# EAGLE design RFID-reader-schmatic (EAGLE 8.4.1)
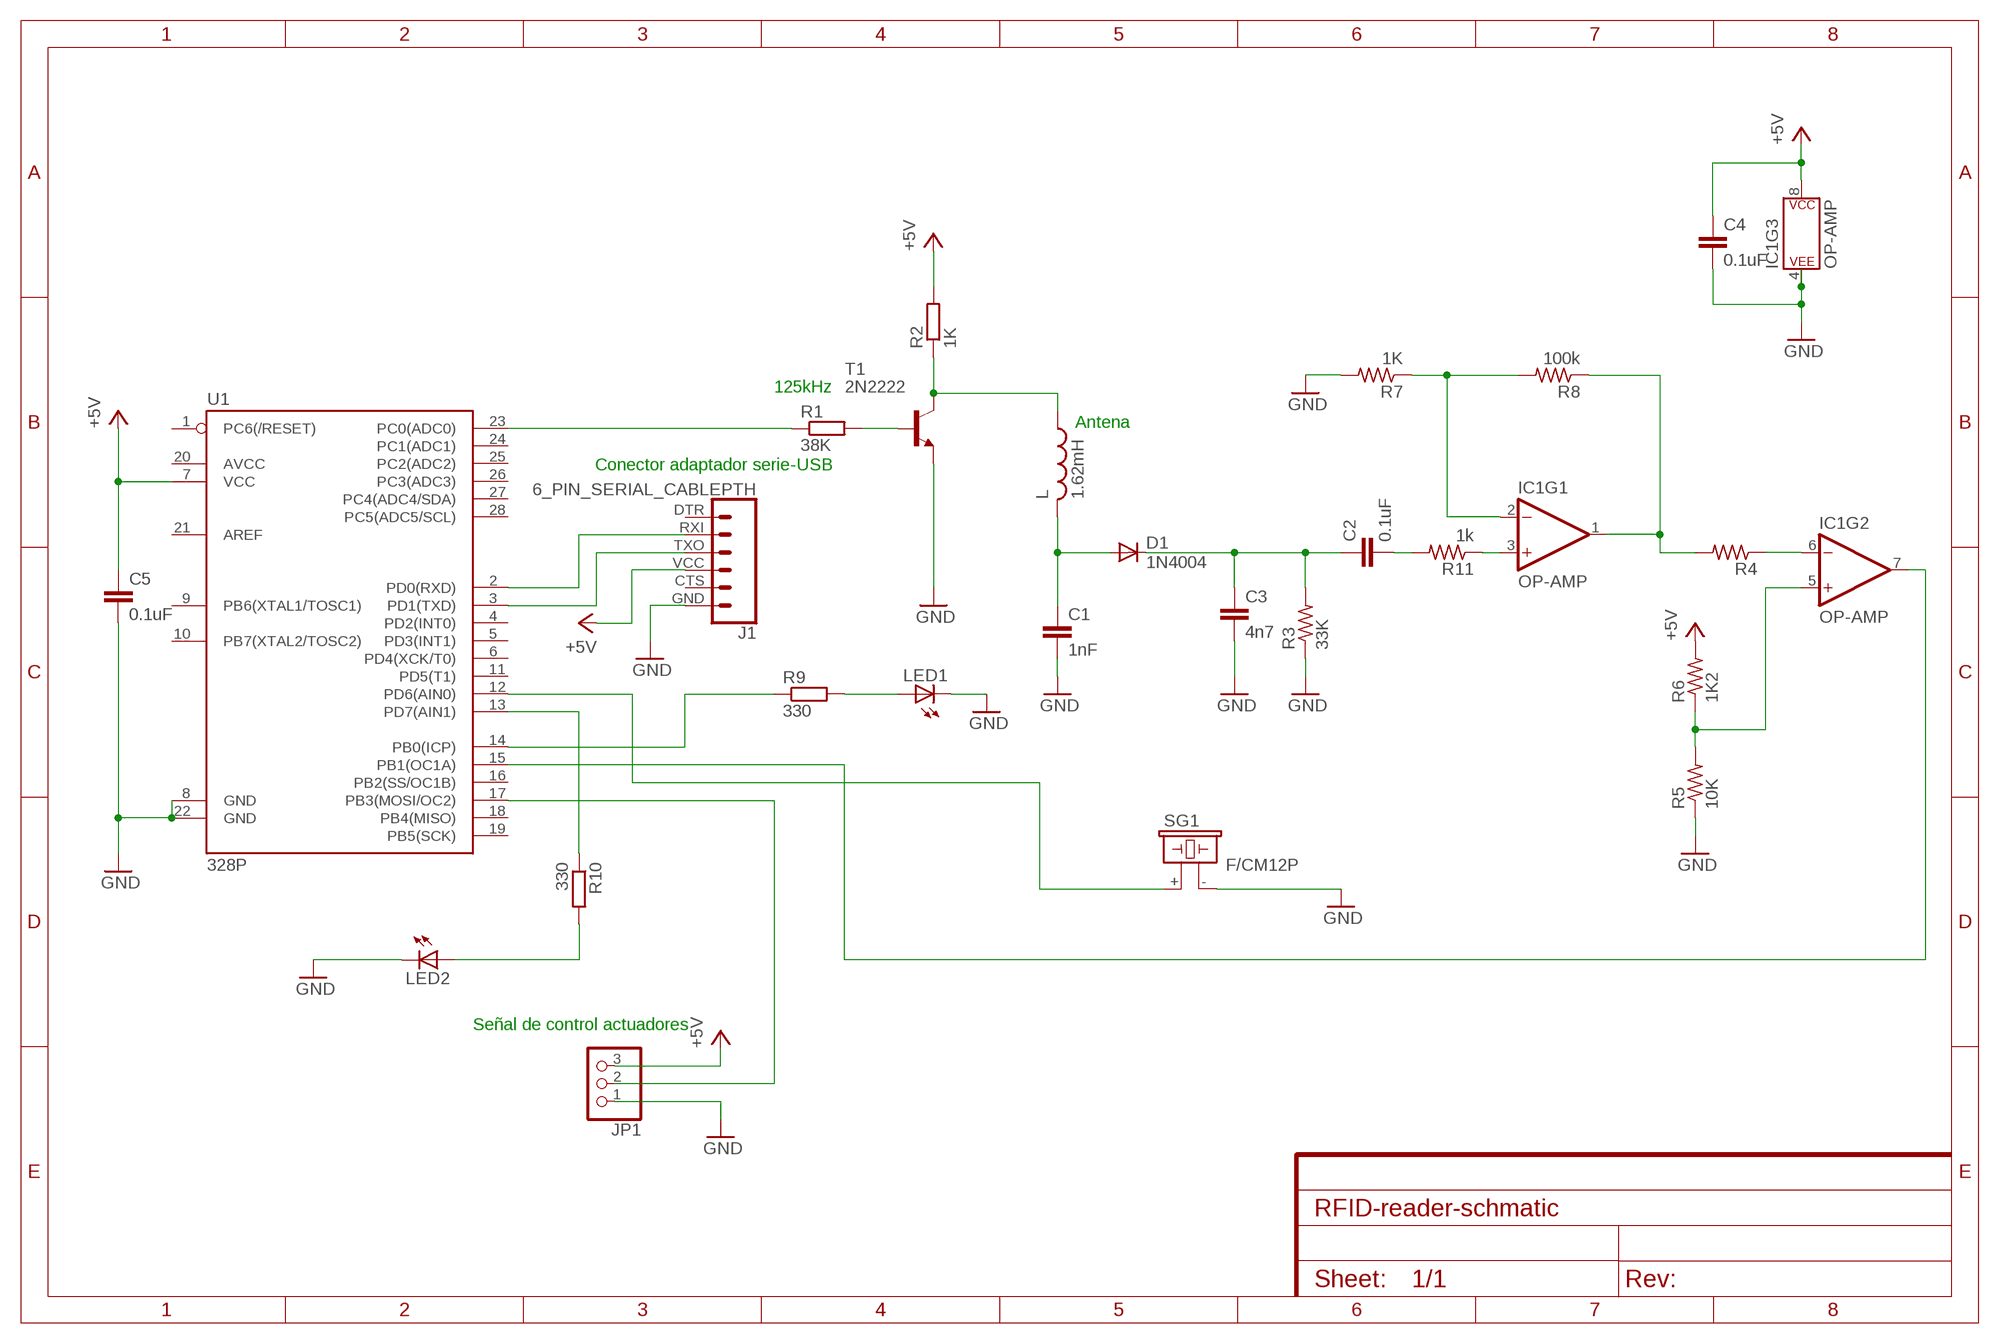
[diagram p0: schematic, sheet 1]
FRAME1 (FRAME-A4L): SPICEPREFIX: X

## Parts
C1  1nF  C2,5-3  [C2.5-3]
C2  0.1uF  C2,5-3  [C2.5-3]
C3  4n7  C2,5-3  [C2.5-3]
C4  0.1uF  C2,5-3  [C2.5-3]
C5  0.1uF  C2,5-3  [C2.5-3]
D1  1N4004  [DO41-10]
IC1  OP-AMP  OPAMP-DUALDIP  [DIP08]
J1  6_PIN_SERIAL_CABLEPTH  [FTDI_BASIC]
JP1  PINHD-1X3  [1X03]
L  1.62mH  L  [6000]
LED1  LED3MM  [LED3MM]
LED2  LED3MM  [LED3MM]
R1  38K  R-EU_0204/7  [0204/7]
R2  1K  R-EU_0204/7  [0204/7]
R3  33K  R-US_0204/7  [0204/7]
R4  R-US_0204/7  [0204/7]
R5  10K  R-US_0204/7  [0204/7]
R6  1K2  R-US_0204/7  [0204/7]
R7  1K  R-US_0204/7  [0204/7]
R8  100k  R-US_0204/7  [0204/7]
R9  330  R-EU_0204/7  [0204/7]
R10  330  R-EU_0204/7  [0204/7]
R11  1k  R-US_0204/7  [0204/7]
SG1  F/CM12P  [F/CM12P]
T1  2N2222  [TO92-EBC-OVAL]
U1  328P  ATMEGA328P_PDIP  [DIP28]

## Nets
GND: C1.2 C3.2 C4.2 C5.2 IC1.4(P$V-) J1.GND JP1.1 LED1.K(C) LED2.K(C) R3.1 R5.1 R7.2 SG1.- T1.E U1.8(GND) U1.22(GND)
N$1: R10.1 U1.13(PD7(AIN1))
N$2: L.1 R2.1 T1.C
N$3: R1.2 T1.B
N$4: R1.1 U1.23(PC0(ADC0))
N$5: C1.1 D1.A L.2
N$6: IC1.6(-IN) R4.1
N$7: R9.1 U1.14(PB0(ICP))
N$8: C2.1 C3.1 D1.C R3.2
N$11: IC1.7(OUT) U1.15(PB1(OC1A))
N$13: IC1.5(+IN) R5.2 R6.1
N$14: C4.1 IC1.8(P$V+) ; supply symbol labelled +5V
N$16: C2.2 R11.2
N$17: IC1.1(OUT) R4.2 R8.1
N$18: IC1.2(-IN) R7.1 R8.2
N$19: SG1.+ U1.12(PD6(AIN0))
N$20: LED1.A R9.2
N$21: JP1.2 U1.17(PB3(MOSI/OC2))
N$23: J1.RXI U1.2(PD0(RXD))
N$24: J1.TXO U1.3(PD1(TXD))
N$26: LED2.A R10.2
N$27: IC1.3(+IN) R11.1
VCC: C5.1 J1.VCC JP1.3 R2.2 R6.2 U1.7(VCC) ; supply symbol labelled +5V
Unconnected: J1.CTS J1.DTR U1.1(PC6(/RESET)) U1.4(PD2(INT0)) U1.5(PD3(INT1)) U1.6(PD4(XCK/T0)) U1.9(PB6(XTAL1/TOSC1)) U1.10(PB7(XTAL2/TOSC2)) U1.11(PD5(T1)) U1.16(PB2(SS/OC1B)) U1.18(PB4(MISO)) U1.19(PB5(SCK)) U1.20(AVCC) U1.21(AREF) U1.24(PC1(ADC1)) U1.25(PC2(ADC2)) U1.26(PC3(ADC3)) U1.27(PC4(ADC4/SDA)) U1.28(PC5(ADC5/SCL))

## Notes on the sheet
- 125kHz
- Antena
- Conector adaptador serie-USB
- Señal de control actuadores

## Library data of the parts
C1-C5 = capacitor-wima:C: CAPACITOR naming: grid - package width
D1 = adafruit:1N4004: DIODE General purpose 1N400x type rectifier (With bigger pads) http://www.ladyada.net/library/pcb/eaglelibrary.html
IC1 = SparkFun-IC-Amplifiers:OPAMP-DUAL: Generic op-amp footprint This component is for the standard 358 pinning of a dual op-amp From the LM358 datasheet: Pin 1: Output A Pin 2: Inverting Input A Pin 3: Non-Inverting Input A Pin 4: Gnd Pin 5: Non-Inverting Input B Pin 6: Inverting Input B Pin 7: Output B Pin 8: V+; PROD_ID: NA-XXXXX
J1 = SparkFun-Connectors:6_PIN_SERIAL_CABLE: 6-pin header connection for use with the "FTDI BASIC" pinout - CABLE SIDE. Also known as "Arduino Serial Program Header". This is used on a design to provide a 6-pin connection point for serial communication usually from a USB cable (D+/D-) to these headers (RX/TX). It also has the remaining pins necessary for programming in the Arduino evironment (DTR, GND, and sometimes VCC). Note, this device has "CABLE" in the name. It is intended to be used on a design that usually lives on the end of your USB cable and prvides the converter chip (FTDI232 or FTDI231x) to commnicate serial RX/TX. The "sister" device, named "TARGET" is inteneded to be used on a design that contains a target micro-controller that you wish to program. You can populate with some of these: Female Headers <https://www.sparkfun.com/products/115> (PRT-00115) For reference (or to suit your programming needs) check out these designs: SparkFun FTDI Basic Breakout - 5V <https://www.sparkfun.com/products/9716> (DEV-09716) SparkFun FTDI Basic Breakout - 3.3V <https://www.sparkfun.com/products/9873> (DEV-09873) SparkFun FTDI SmartBasic <https://www.sparkfun.com/products/12935> (DEV-12935) SparkFun Beefy 3 - FTDI Basic Breakout <https://www.sparkfun.com/products/13746> (DEV-13746)
JP1 = adafruit:PINHD-1X3: PIN HEADER
L = adafruit:L
LED1 LED2 = adafruit:LED: LED OSRAM: - CHIPLED LG R971, LG N971, LY N971, LG Q971, LY Q971, LO R971, LY R971 LH N974, LH R974 LS Q976, LO Q976, LY Q976 LO Q996 - Hyper CHIPLED LW Q18S LB Q993, LB Q99A, LB R99A - SideLED LS A670, LO A670, LY A670, LG A670, LP A670 LB A673, LV A673, LT A673, LW A673 LH A674 LY A675 LS A676, LA A676, LO A676, LY A676, LW A676 LS A679, LY A679, LG A679 - Hyper Micro SIDELED® LS Y876, LA Y876, LO Y876, LY Y876 LT Y87S - SmartLED LW L88C, LW L88S LB L89C, LB L89S, LG L890 LS L89K, LO L89K, LY L89K LS L896, LA L896, LO L896, LY L896 - TOPLED LS T670, LO T670, LY T670, LG T670, LP T670 LSG T670, LSP T670, LSY T670, LOP T670, LYG T670 LG T671, LOG T671, LSG T671 LB T673, LV T673, LT T673, LW T673 LH T674 LS T676, LA T676, LO T676, LY T676, LB T676, LH T676, LSB T676, LW T676 LB T67C, LV T67C, LT T67C, LS T67K, LO T67K, LY T67K, LW E67C LS E67B, LA E67B, LO E67B, LY E67B, LB E67C, LV E67C, LT E67C LW T67C LS T679, LY T679, LG T679 LS T770, LO T770, LY T770, LG T770, LP T770 LB T773, LV T773, LT T773, LW T773 LH T774 LS E675, LA E675, LY E675, LS T675 LS T776, LA T776, LO T776, LY T776, LB T776 LHGB T686 LT T68C, LB T68C - Hyper Mini TOPLED® LB M676 - Mini TOPLED Santana® LG M470 LS M47K, LO M47K, LY M47K Source: http://www.osram.convergy.de/
R1 R2 R9 R10 = resistor:R-EU_: RESISTOR, European symbol
R3-R8 R11 = adafruit:R-US_: RESISTOR, American symbol
SG1 = buzzer:F/CM12P: BUZZER Source: Buerklin; OC_FARNELL: unknown; OC_NEWARK: unknown
T1 = adafruit:2N2222: NPN TRANSISTOR Big oval pads
U1 = SparkFun-IC-Microcontroller:ATMEGA328P_PDIP: Atmel 328P Through hole ATMEGA328P uC used in the Arduino 32kb flash, 1k EEPROM, 2k SRAM Datasheet <http://www.sparkfun.com/datasheets/Components/SMD/ATMega328.pdf> SparkFun Products Storefront component: AVR 28 Pin 20MHz 32K 6A/D - ATMega328P <https://www.sparkfun.com/products/9061> (COM-09061) SparkFun Simon Says - Through-Hole Soldering Kit <https://www.sparkfun.com/products/10547> (KIT-10547) SparkFun Learn to Solder - Simon Says <https://www.sparkfun.com/products/13708> (KIT-13708) SparkFun BigTime Watch Kit <https://www.sparkfun.com/products/11734> (KIT-11734) SparkFun ClockIt <https://www.sparkfun.com/products/10930> (KIT-10930) SparkFun Serial Enabled LCD Kit <https://www.sparkfun.com/products/10097> (LCD-10097) SparkFun Simon Tilts - Through Hole Soldering Kit <https://www.sparkfun.com/products/12634> (KIT-12634) SparkFun Frequency Counter Kit <https://www.sparkfun.com/products/10140> (KIT-10140) FabFM Radio Kit <https://www.sparkfun.com/products/11043> (KIT-11043) SparkFun Binary Blaster Kit <https://www.sparkfun.com/products/12037> (KIT-12037) SparkFun Metro-Gnome <https://www.sparkfun.com/products/9236> (KIT-09236) ATmega328 with Arduino Optiboot (Uno) <https://www.sparkfun.com/products/10524> (DEV-10524); PROD_ID: IC-09136

## Board
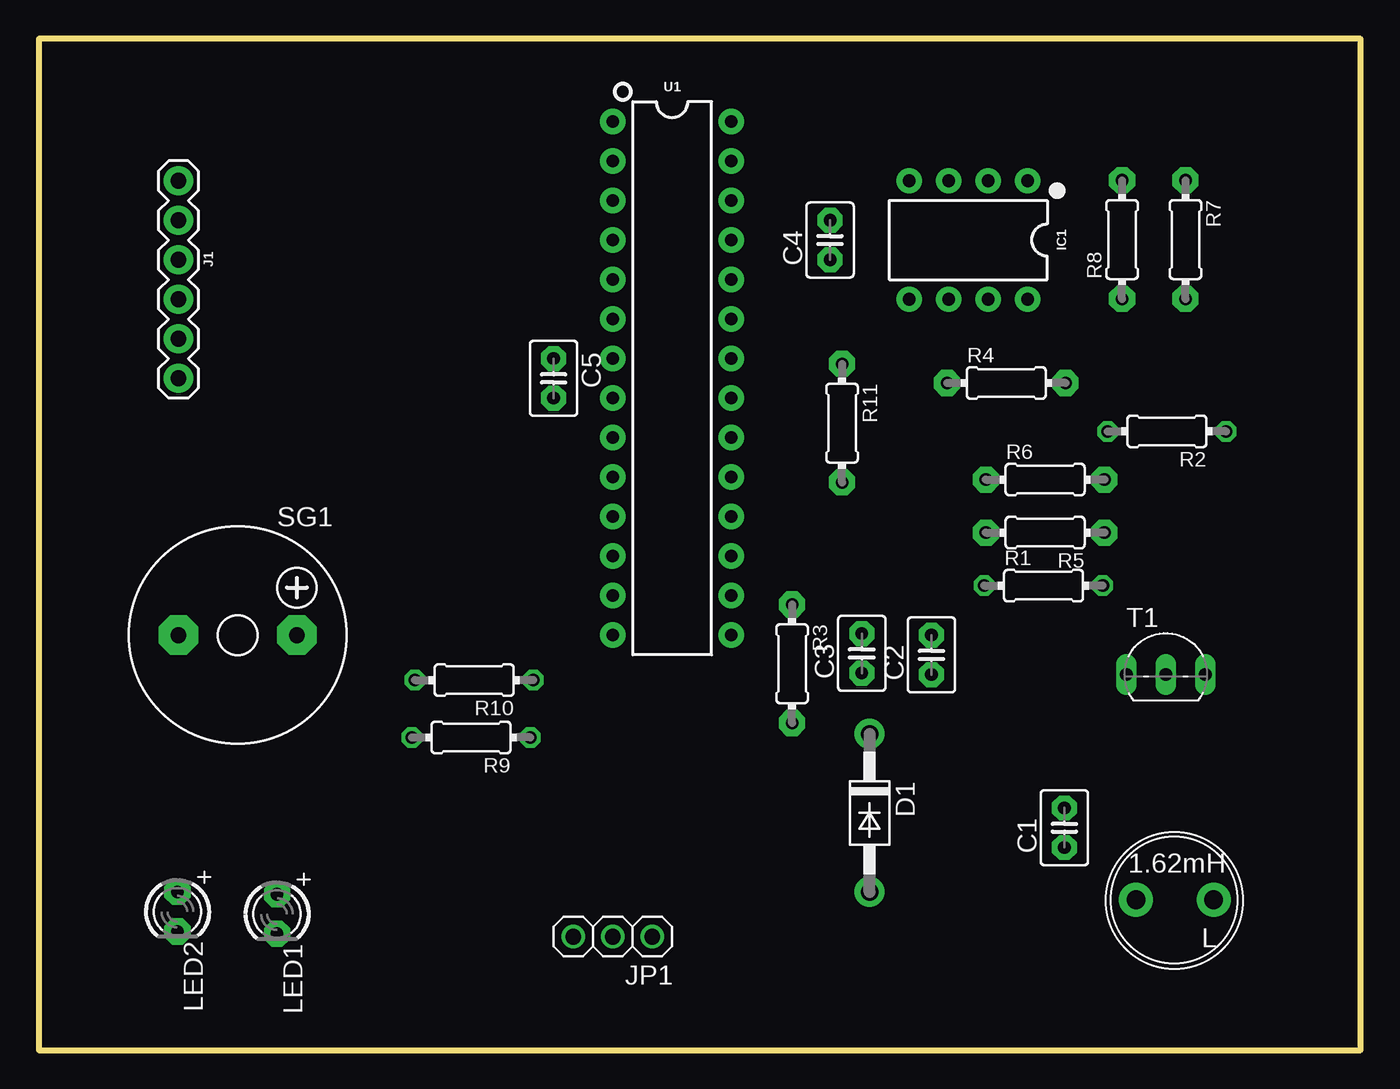
[diagram p1: board, top side]
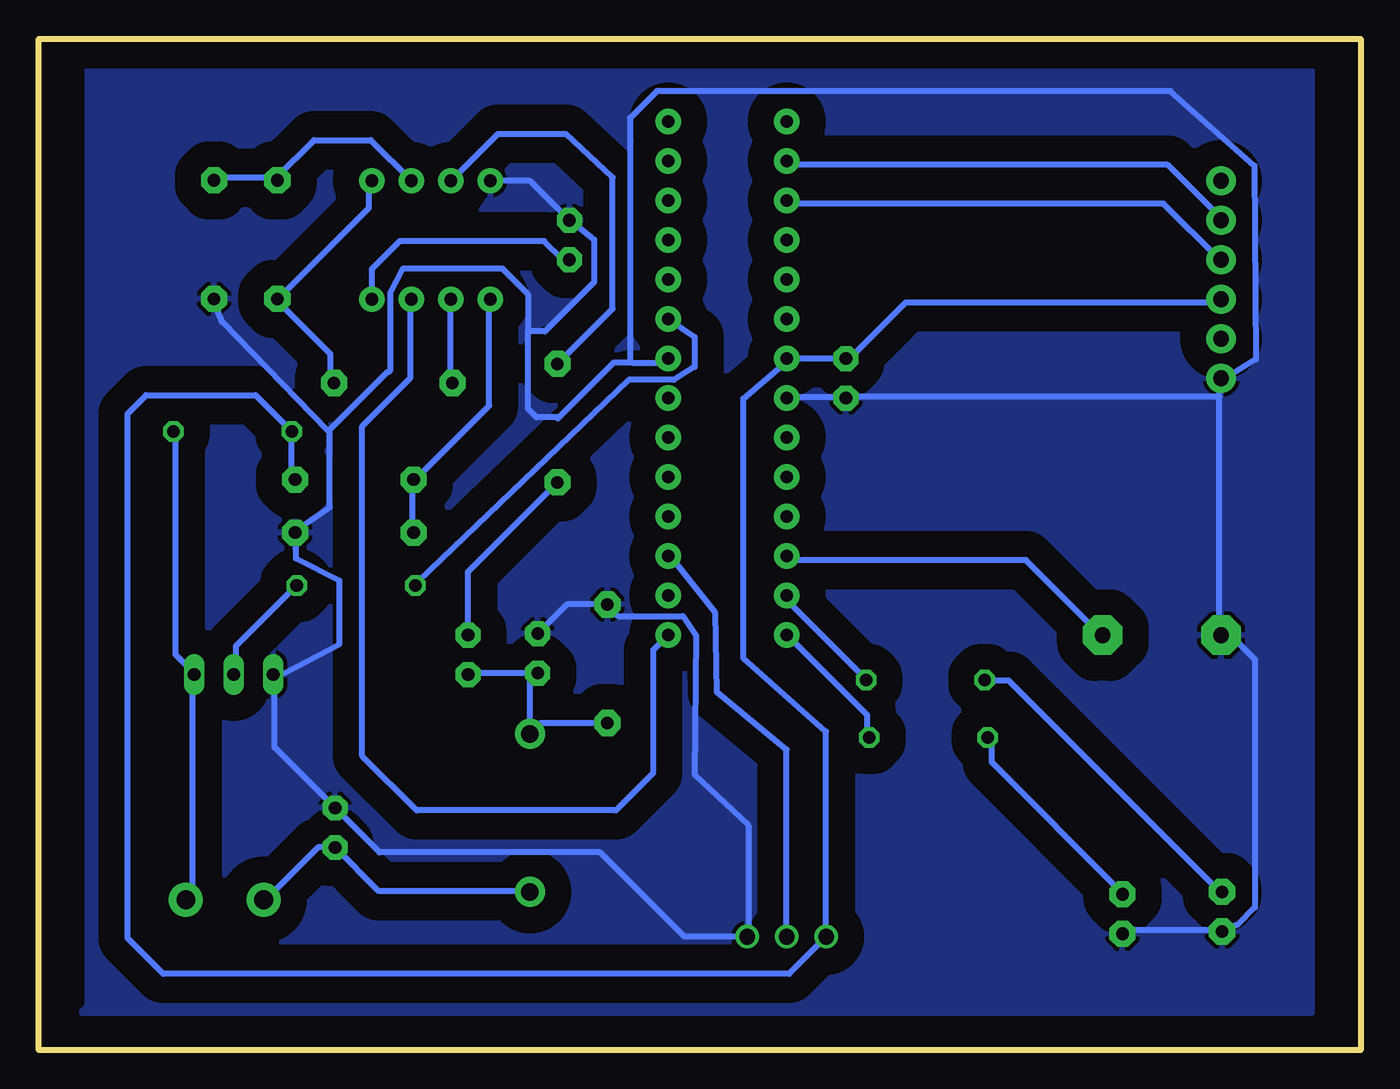
[diagram p2: board, bottom side, seen from below]

Size 85 x 65 mm. Coordinates in mm from the lower left corner, seen from the top.
Outline: 0,65 0,0 85,0 85,65 0,65
Copper layers (1*16): Top 0.035mm / dielectric 1.5mm / Bottom 0.035mm
Design rules "default *": minimum track width 0.4mm, minimum drill 0.4mm, track to track 6mil, track to pad 6mil, pad to pad 6mil, via to via 6mil, smd to smd 6mil, copper to edge 0.4mm, drill to drill 0.4mm, minimum pad ring 10mil, minimum via ring 8mil, stop-mask expansion 4mil, vias tented up to drill 0mil, thermal gap 10mil

### Footprints (pad centres in the part's own frame; a part is rotated, then mirrored left to right if it is on the bottom)
C2.5-3 = drill 0.813 pad 1.6 octagon: 1 -1.27,0; 2 1.27,0
DO41-10 = drill 1.118 pad 1.93: A 5.08,0; C -5.08,0
DIP08 = drill 0.813 pad 1.626: 1 -3.81,-3.81; 2 -1.27,-3.81; 3 1.27,-3.81; 4 3.81,-3.81; 5 3.81,3.81; 6 1.27,3.81; 7 -1.27,3.81; 8 -3.81,3.81
FTDI_BASIC = drill 1.016 pad 1.88: CTS 10.16,0; DTR 0,0; GND 12.7,0; RXI 2.54,0; TXO 5.08,0; VCC 7.62,0
1X03 = drill 1.016: 1 -2.54,0; 2 0,0; 3 2.54,0
6000 = drill 1.2 pad 2.184: 1 -2.5,0; 2 2.5,0
LED3MM = drill 0.813 pad 1.676 octagon: A -1.27,0; K 1.27,0
0204/7 = drill 0.813 octagon: 1 -3.81,0; 2 3.81,0
0204/7' = drill 0.813 pad 1.676 octagon: 1 -3.81,0; 2 3.81,0
F/CM12P = drill 1.016 pad 2.54 octagon: + 3.81,0; - -3.81,0
TO92-EBC-OVAL = drill 0.813 long: B 0,-1.27; C 2.54,-1.27; E -2.54,-1.27
DIP28 = drill 0.813 pad 1.626: 1 -16.51,-3.81; 2 -13.97,-3.81; 3 -11.43,-3.81; 4 -8.89,-3.81; 5 -6.35,-3.81; 6 -3.81,-3.81; 7 -1.27,-3.81; 8 1.27,-3.81; 9 3.81,-3.81; 10 6.35,-3.81; 11 8.89,-3.81; 12 11.43,-3.81; 13 13.97,-3.81; 14 16.51,-3.81; 15 16.51,3.81; 16 13.97,3.81; 17 11.43,3.81; 18 8.89,3.81; 19 6.35,3.81; 20 3.81,3.81; 21 1.27,3.81; 22 -1.27,3.81; 23 -3.81,3.81; 24 -6.35,3.81; 25 -8.89,3.81; 26 -11.43,3.81; 27 -13.97,3.81; 28 -16.51,3.81

### Placement (x,y rotation side)
C1  65.95,14.29 90 top
C2  57.4,25.4 90 top
C3  52.92,25.5 90 top
C4  50.88,52.07 90 top
C5  33.1,43.18 270 top
D1  53.42,15.24 270 top
IC1  59.77,52.07 180 top
J1  8.97,55.88 270 top
JP1  36.91,7.29 180 top
L  73.05,9.66 180 top
LED1  15.31,8.74 270 top
LED2  8.91,8.89 270 top
R1  64.61,29.85 0 top
R2  72.54,39.77 180 top
R3  33K  [0204/7']  48.44,24.83 270 top
R4  [0204/7']  62.21,42.88 0 top
R5  10K  [0204/7']  64.71,33.26 180 top
R6  1K2  [0204/7']  64.71,36.67 0 top
R7  1K  [0204/7']  73.74,52.1 270 top
R8  100k  [0204/7']  69.66,52.1 90 top
R9  27.79,20.09 180 top
R10  27.99,23.78 180 top
R11  1k  [0204/7']  51.65,40.3 270 top
SG1  12.78,26.67 0 top
T1  72.47,25.4 0 top
U1  40.72,43.18 270 top

### Tracks (layer width: path | path; a pad name or v marks a point on that pad's centre or on a via)
GND
  Bottom 0.4: LED1.K 15.16,7.73 9.09,7.73 LED2.K 8.81,7.73 7.91,8.06 6.8,9.17 6.8,25.11 7.91,26.21 SG1.- 9.09,26.79 9.09,41.98 | U1.8 36.71,41.98 33.12,41.98 C5.2 32.84,41.98 9.09,41.98 | 9.09,41.98 9.09,43.09 J1.GND 8.81,43.36 8.81,43.12 6.73,44.4 6.83,56.84 12.22,61.64 45.26,61.64 47,59.9 47,44.29 46.9,44.19 | 66.29,39.87 66.43,39.81 73.22,46.8 73.72,48.06 R7.2 | 66.29,39.87 66.29,34.9 68.47,33.42 R5.1 68.47,33.14 68.47,31.59 65.66,30.18 65.66,26.09 69.85,23.91 T1.E 69.85,24.03 69.85,19.46 C1.2 63.09,12.7 48.9,12.7 43.49,7.29 JP1.1 39.37,7.36 39.37,14.44 42.84,17.7 42.73,26.64 43.59,27.9 47.75,27.9 48.31,28.45 R3.1 51.05,28.64 C3.2 | 51.07,53.58 C4.2 | 55.76,55.79 IC1.4 53.42,55.88 C4.2 | 46.9,44.19 48.03,44.19 51.56,40.66 | 46.9,44.19 44.72,44.19 U1.22 | 51.62,40.6 51.56,40.66 | 53.55,46.2 53.55,41.23 52.99,40.66 51.56,40.66 | C4.2 50.79,53.31 49.29,52.1 49.29,49.37 52.45,46.2 53.55,46.2 | 53.55,46.2 53.55,48.58 55.21,50.24 61.56,50.24 62.39,48.71 62.39,43.71 62.5,43.6 62.56,43.6 66.29,39.87
  pour Bottom (isolate 1.676): 3.1,2.4 3.1,62.9 3.5,63.3 81.8,63.3 81.9,63.2 81.9,2.8 82.3,2.4 3.7,2.4
N$1
  Bottom 0.4: R10.1 32.01,24.03 36.98,29 U1.13
N$2
  Bottom 0.4: L.1 75.37,9.67 75.1,9.94 75.1,24.03 T1.C 75.1,24.31 76.2,25.41 76.2,39.5 R2.1
N$3
  Bottom 0.4: T1.B 72.34,24.31 72.34,25.96 68.47,29.83 R1.2
N$4
  Bottom 0.4: R1.1 60.84,29.81 60.65,30.11 47.07,43.09 44.16,43.09 42.84,43.92 42.84,45.85 44.44,46.95 U1.23
N$5
  Bottom 0.4: L.2 70.4,9.67 67.05,13.02 C1.1 63.15,10.22 53.55,10.22 D1.A
N$6
  Bottom 0.4: IC1.6 58.53,48.06 58.53,43.09 R4.1
N$7
  Bottom 0.4: R9.1 31.73,20.16 31.73,21.54 36.71,26.52 U1.14
N$8
  Bottom 0.4: R3.2 52.72,21.02 D1.C 53.42,23.73 C3.1 57.3,24.23 C2.1
N$11
  Bottom 0.4: U1.15 45.5,25.7 45.5,17.8 47.9,15.4 60.7,15.4 64.2,18.9 64.2,40.1 61.1,43.2 61.1,48.2 IC1.7
N$13
  Bottom 0.4: IC1.5 56.04,48.06 56.04,41.43 60.74,36.73 R6.1 61.01,36.46 61.01,33.42 R5.2
N$14
  Bottom 0.4: 63.6,48.34 IC1.8 63.6,48.28 63.6,50.2 61.8,52 52.5,52 51.3,50.8 C4.1
N$16
  Bottom 0.4: C2.2 57.4,30.74 R11.2
N$17
  Bottom 0.4: IC1.1 63.77,55.79 63.77,54.13 69.57,48.34 R8.1 69.57,48.06 66.26,44.74 66.26,43.09 R4.2
N$18
  Bottom 0.4: 69.77,56.07 R8.2 69.85,56.07 | 69.85,56.07 73.72,56.07 R7.1 | 69.85,56.07 69.73,56.07 67.3,58.5 63.66,58.5 IC1.2
N$19
  Bottom 0.4: U1.12 36.71,31.49 21.52,31.49 16.82,26.79 SG1.+
N$20
  Bottom 0.4: R9.2 23.73,19.89 23.73,18.5 15.44,10.22 LED1.A
N$21
  Bottom 0.4: 36.98,7.46 JP1.2 36.91,19.31 41.4,23 41.5,28.1 44.62,32.02 | 44.62,32.02 44.44,31.49 | 44.62,32.02 U1.17
N$23
  Bottom 0.4: U1.2 36.71,56.9 12.4,56.9 9.09,53.58 J1.RXI
N$24
  Bottom 0.4: U1.3 36.71,54.41 12.68,54.41 9.09,50.82 J1.TXO
N$26
  Bottom 0.4: R10.2 24,23.75 22.62,23.75 9.09,10.22 LED2.A
N$27
  Bottom 0.4: IC1.3 55.48,58.9 51.1,58.9 48.1,56.1 48.1,47.66 R11.1
VCC
  Bottom 0.4: R6.2 68.75,36.73 68.75,39.5 R2.2 71.06,42.1 78.1,42.1 79.3,40.9 79.3,7.2 77,4.9 36.76,4.9 JP1.3 | 34.5,7.46 JP1.3 | J1.VCC 9.09,48.06 29.25,48.06 32.84,44.47 C5.1 33.12,44.47 36.71,44.47 U1.7 36.98,44.19 39.7,41.87 39.7,25.2 34.37,20.47 JP1.3